# EAGLE design working (EAGLE 9.6.2)
COMPANY: ADAFRUIT INDUSTRIES; DRAWN: KTOWN; REV: D; YEAR: 2018
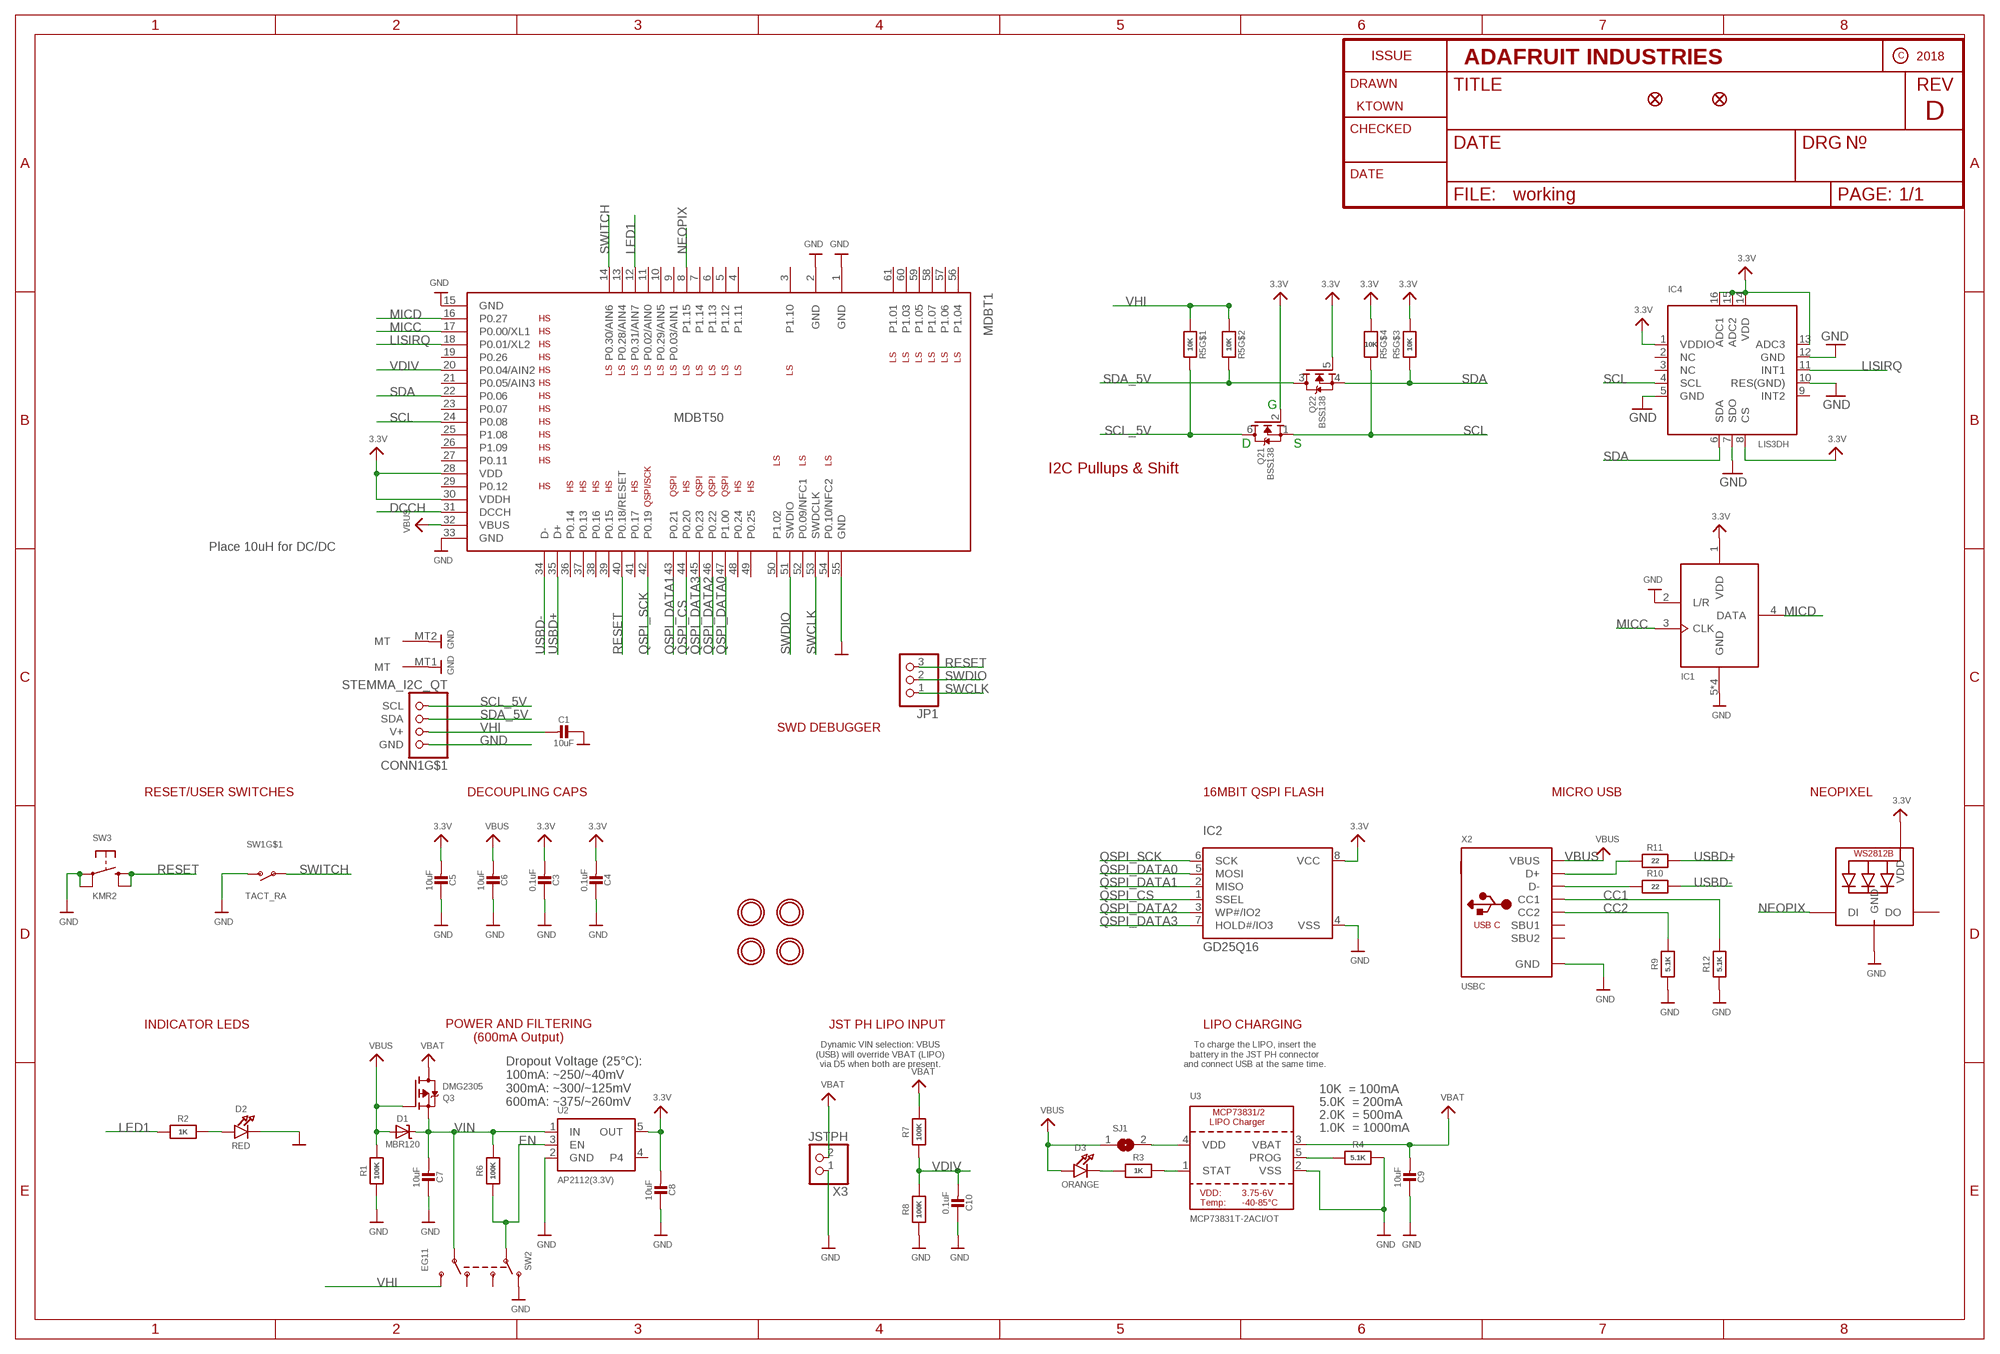
[diagram p0: schematic, sheet 1]

## Parts
C1  10uF  CAP_CERAMIC0805-NOOUTLINE  [0805-NO]
C3  0.1uF  CAP_CERAMIC0603_NO  [0603-NO]
C4  0.1uF  CAP_CERAMIC0603_NO  [0603-NO]
C5  10uF  CAP_CERAMIC0805-NOOUTLINE  [0805-NO]
C6  10uF  CAP_CERAMIC0805-NOOUTLINE  [0805-NO]
C7  10uF  CAP_CERAMIC0805-NOOUTLINE  [0805-NO]
C8  10uF  CAP_CERAMIC0805-NOOUTLINE  [0805-NO]
C9  10uF  CAP_CERAMIC0805-NOOUTLINE  [0805-NO]
C10  0.1uF  CAP_CERAMIC0603_NO  [0603-NO]
CONN1  STEMMA_I2C_QT  [JST_SH4]
D1  MBR120  DIODE-SCHOTTKYSOD-123  [SOD-123]
D2  RED  LED0805_NOOUTLINE  [CHIPLED_0805_NOOUTLINE]
D3  ORANGE  LED0805_NOOUTLINE  [CHIPLED_0805_NOOUTLINE]
FID1  FIDUCIAL_1MM  [FIDUCIAL_1MM]
FID2  FIDUCIAL_1MM  [FIDUCIAL_1MM]
IC1  MIC_PDM_SPK0415  [SPK0415HM4H]
IC2  GD25Q16  SPIFLASH_8PIN  [SOIC8_150MIL]
IC4  LIS3DH  ACCEL_LIS3DHTR  [LGA16_3X3MM]
JP1  HEADER-1X3ROUND  [1X03_ROUND]
LED1  WS2812B_SK6805_1515  [SK6805_1515]
MDBT1  MDBT50  [MDBT50]
Q2  BSS138  MOSFET-N_DUAL  [SOT363]
Q3  DMG2305  MOSFET-P  [SOT23-R]
R1  100K  RESISTOR_0603_NOOUT  [0603-NO]
R2  1K  RESISTOR_0603_NOOUT  [0603-NO]
R3  1K  RESISTOR_0603_NOOUT  [0603-NO]
R4  5.1K  RESISTOR_0603_NOOUT  [0603-NO]
R5  10K  RESISTOR_4PACK  [RESPACK_4X0603]
R6  100K  RESISTOR_0603_NOOUT  [0603-NO]
R7  100K  RESISTOR_0603_NOOUT  [0603-NO]
R8  100K  RESISTOR_0603_NOOUT  [0603-NO]
R9  5.1K  RESISTOR_0603_NOOUT  [0603-NO]
R10  22  RESISTOR_0603_NOOUT  [0603-NO]
R11  22  RESISTOR_0603_NOOUT  [0603-NO]
R12  5.1K  RESISTOR_0603_NOOUT  [0603-NO]
SJ1  SOLDERJUMPER  [SOLDERJUMPER_ARROW_NOPASTE]
SW1  TACT_RA  SWITCH_SPST_TACT_RA  [SPST_TACTILE_RA]
SW2  EG11  SWITCH_DPDTEG1390  [EG1390]
SW3  KMR2  SWITCH_TACT_SMT4.6X2.8  [BTN_KMR2_4.6X2.8]
U2  AP2112(3.3V)  VREG_SOT23-5  [SOT23-5]
U3  MCP73831T-2ACI/OT  MCP73831/2  [SOT23-5]
U$10  MOUNTINGHOLE_SLOT4MM  [SLOT_4MM_PLATED]
U$12  MOUNTINGHOLE_SLOT4MM  [SLOT_4MM_PLATED]
U$14  MOUNTINGHOLE_SLOT4MM  [SLOT_4MM_PLATED]
U$16  MOUNTINGHOLE_SLOT4MM  [SLOT_4MM_PLATED]
X2  USBC  USB_C  [USB_C_CUSB31-CFM2AX-01-X]
X3  JSTPH  CON_JST_PH_2PIN_BATT  [JSTPH2_BATT]

## Nets
3.3V [highpower]: C3.2 C4.2 C5.2 C8.2 IC1.1(VDD) IC2.8(VCC) IC4.1(VDDIO) IC4.8(CS) IC4.13(ADC3) IC4.14(VDD) IC4.15(ADC2) IC4.16(ADC1) LED1.2(VDD) MDBT1.28(VDD) MDBT1.30(VDDH) Q2.2(1:G) Q2.5(2:G) R5.3 R5.5 U2.5(OUT)
CC1: R12.2 X2.A5(CC1)
CC2: R9.2 X2.B5(CC2)
D+: R11.1 X2.A6(D+) X2.B6(D+)
D-: R10.1 X2.A7(D-) X2.B7(D-)
DCCH: MDBT1.31(DCCH)
EN: R6.1 SW2.P1 U2.3(EN)
GND: C1.1 C3.1 C4.1 C5.1 C6.1 C7.1 C8.1 C9.1 C10.1 CONN1.1(GND) CONN1.MT1(MT) CONN1.MT2(MT) D2.C IC1.2(L/R) IC1.5(GND) IC1.6(GND) IC1.7(GND) IC1.8(GND) IC2.4(VSS) IC4.5(GND) IC4.7(SDO) IC4.10(RES(GND)) IC4.12(GND) LED1.4(GND) MDBT1.1(GND) MDBT1.2(GND) MDBT1.15(GND) MDBT1.33(GND) MDBT1.55(GND) R1.1 R4.2 R8.1 R9.1 R12.1 SW1.2(S) SW2.O1 SW3.A'(P1) SW3.A(P) U2.2(GND) U3.2(VSS) X2.A1B12(GND) X2.B1A12(GND) X3.1
LED1: MDBT1.12(P0.31/AIN7) R2.1
LISIRQ: IC4.11(INT1) MDBT1.18(P0.01/XL2)
MICC: IC1.3(CLK) MDBT1.17(P0.00/XL1)
MICD: IC1.4(DATA) MDBT1.16(P0.27)
N$1: D3.C R3.1
N$2 [highpower]: SJ1.2 U3.4(VDD)
N$5: D2.A R2.2
N$11: R3.2 U3.1(STAT)
N$12: R4.1 U3.5(PROG)
NEOPIX: LED1.1(DI) MDBT1.8(P1.15)
QSPI_CS: IC2.1(SSEL) MDBT1.44(P0.20)
QSPI_DATA0: IC2.5(MOSI) MDBT1.47(P1.00)
QSPI_DATA1: IC2.2(MISO) MDBT1.43(P0.21)
QSPI_DATA2: IC2.3(WP#/IO2) MDBT1.46(P0.22)
QSPI_DATA3: IC2.7(HOLD#/IO3) MDBT1.45(P0.23)
QSPI_SCK: IC2.6(SCK) MDBT1.42(P0.19)
RESET: JP1.3 MDBT1.40(P0.18/RESET) SW3.B'(S1) SW3.B(S)
SCL: IC4.4(SCL) MDBT1.24(P0.08) Q2.1(1:S) R5.4
SCL_5V: CONN1.4(SCL) Q2.6(1:D) R5.8
SDA: IC4.6(SDA) MDBT1.22(P0.06) Q2.4(2:S) R5.6
SDA_5V: CONN1.3(SDA) Q2.3(2:D) R5.7
SWCLK: JP1.1 MDBT1.53(SWDCLK)
SWDIO: JP1.2 MDBT1.51(SWDIO)
SWITCH: MDBT1.14(P0.30/AIN6) SW1.1(P)
USBD+: MDBT1.35(D+) R11.2
USBD-: MDBT1.34(D-) R10.2
VBAT [highpower]: C9.2 Q3.3(D) R7.2 U3.3(VBAT) X3.2
VBUS [highpower]: C6.2 D1.A D3.A MDBT1.32(VBUS) Q3.1(G) R1.2 SJ1.1 X2.A4B9(VBUS) X2.B4A9(VBUS)
VDIV: C10.2 MDBT1.20(P0.04/AIN2) R7.1 R8.2
VHI [highpower]: C1.2 CONN1.2(V+) R5.1 R5.2 SW2.S2
VIN [highpower]: C7.2 D1.C Q3.2(S) R6.2 SW2.P2 U2.1(IN)
Unconnected: IC4.2(NC) IC4.3(NC) IC4.9(INT2) LED1.3(DO) MDBT1.3(P1.10) MDBT1.4(P1.11) MDBT1.5(P1.12) MDBT1.6(P1.13) MDBT1.7(P1.14) MDBT1.9(P0.03/AIN1) MDBT1.10(P0.29/AIN5) MDBT1.11(P0.02/AIN0) MDBT1.13(P0.28/AIN4) MDBT1.19(P0.26) MDBT1.21(P0.05/AIN3) MDBT1.23(P0.07) MDBT1.25(P1.08) MDBT1.26(P1.09) MDBT1.27(P0.11) MDBT1.29(P0.12) MDBT1.36(P0.14) MDBT1.37(P0.13) MDBT1.38(P0.16) MDBT1.39(P0.15) MDBT1.41(P0.17) MDBT1.48(P0.24) MDBT1.49(P0.25) MDBT1.50(P1.02) MDBT1.52(P0.09/NFC1) MDBT1.54(P0.10/NFC2) MDBT1.56(P1.04) MDBT1.57(P1.06) MDBT1.58(P1.07) MDBT1.59(P1.05) MDBT1.60(P1.03) MDBT1.61(P1.01) SW1.MT1(MT) SW1.MT2(MT) SW2.O2 SW2.S1 U2.4 X2.A8(SBU1) X2.B8(SBU2)

## Notes on the sheet
- G
- D | S
- I2C Pullups & Shift
- Place 10uH for DC/DC
- SWD DEBUGGER
- RESET/USER SWITCHES | DECOUPLING CAPS | 16MBIT QSPI FLASH | MICRO USB | NEOPIXEL
- INDICATOR LEDS | JST PH LIPO INPUT | LIPO CHARGING
- POWER AND FILTERING
  (600mA Output)
- Dynamic VIN selection: VBUS
  (USB) will override VBAT (LIPO)
  via D5 when both are present.
- To charge the LIPO, insert the
  battery in the JST PH connector
  and connect USB at the same time.
- 10K  = 100mA
- Dropout Voltage (25°C):
  100mA: ~250/~40mV
  300mA: ~300/~125mV
  600mA: ~375/~260mV
- 5.0K  = 200mA
- 2.0K  = 500mA
- 1.0K  = 1000mA

## Library data of the parts
C1 C3-C10 = microbuilder:CAP_CERAMIC: Ceramic Capacitors For new designs, use the packages preceded by an '_' character since they are more reliable: The following footprints should be used on most boards: _0402 - Standard footprint for regular board layouts _0603 - Standard footprint for regular board layouts _0805 - Standard footprint for regular board layouts _1206 - Standard footprint for regular board layouts For extremely tight-pitch boards where space is at a premium, the following 'micro-pitch' footprints can be used (smaller pads, no silkscreen outline, etc.): _0402MP - Micro-pitch footprint for very dense/compact boards _0603MP - Micro-pitch footprint for very dense/compact boards _0805MP - Micro-pitch footprint for very dense/compact boards _1206MP - Micro-pitch footprint for very dense/compact boards
CONN1 = microbuilder:STEMMA_I2C
D1 = microbuilder:DIODE-SCHOTTKY
D2 D3 = microbuilder:LED: LED 0603 - 0603 Surface Mount Package 2mA: Green LED - Low Power (3.9mcd, 2ma, 1.7Vf) - Digikey: 475-2709-2-ND Orange LED - Low Power (9.8mcd, 2ma, 1.8Vf) - Digikey: 475-1194-2-ND Red LED - Low Power (5mcd, 2ma, 1.8Vf) - Digikey: 475-1195-2-ND Yellow LED - Low Power (7mcd, 2ma, 1.8Vf) - Digikey: 475-1196-2-ND 5mA: Blue LED - Low Power (17mcd, 5ma, 2.9Vf) - Digikey: LNJ937W8CRACT-ND 0805 - 0805 Surface Mount Package 2mA: Red LED (8.8mcd, 2mA, 1.8Vf, Clear) - Low Power [Digikey: 475-2510-1-ND] Green LED (5mcd, 2mA, 1.8Vf, Clear) - Low Power [Digikey: 475-2730-1-ND] Yellow LED (11.3mcd, 2mA, 1.8Vf, Clear) - Low Power [Digikey: 475-2555-1-ND] 20mA: Red LED (104mcd, 20mA, Diffused) - LS R976 [Digikey: 475-1278-6-ND] Red LED (12mcd, 20mA, 2.0Vf, Clear) - APT2012EC [Digikey: 754-1128-1-ND] Green LED (15mcd, 20mA, 2.2Vf, Clear) - APT2012GC [Digikey: 754-1131-1-ND] Orange LED (160mcd, 20mA, 2.1Vf, Clear) - APT2012SECK [Digikey: 754-1130-1-ND] 1206 - 1206 Surface Mount Package Green LED (26mcd, 20mA, Diffused) - LG N971 [Digikey: 475-1407-6-ND] Red LED (15mcd, 20mA, Diffused) - LH N974 [Digikey: 475-1416-6-ND] Cree - Cree High-Power Surface Mount LEDs XPEBWT-L1-0000-00D50 - White 111lm 350mA 2.9Vf 6200K 110° XTEAWT-00-0000-00000LEE3 - White 114lm 350mA 2.85Vf 5000K 115° Everlight - Everlight 45-21 Series Surface Mount LEDs 45-21/QK2C-B2832AC2CB2/2T - Warm White 2000mcd 20mA 3.25Vf 3050K 120° 45-21/LK2C-B38452C4CB2/2T - Nuetral White 2000mcd 20mA 3.25Vf 4150K 120° 45-21/LK2C-B50634C6CB2/2T - Cold White 2200mcd 20mA 3.25Vf 5650K 120° PLCC2 Reverse Mount LS T77K-J1L2-1-0-2-R18-Z - Red 11.25mcd 2mA 1.8Vf 630nm 120° LO T77K-L1M2-24-Z - Orange 19.6mcd 2mA 1.8Vf 606nm 120° LY T77K-K2M1-26-Z - Yellow 15.7mcd 2mA 1.8Vf 587nm 120°
FID1 FID2 = microbuilder:FIDUCIAL: Fiducial Alignment Points Various fiducial points for machine vision alignment.; BOM: EXCLUDE
IC1 = microbuilder:MIC_PDM
IC2 = microbuilder:SPIFLASH_8PIN: SOIC8 SPI Flash Be careful with the size since SOIC8 flash comes in several 'widths' SOIC8 150 mil M25P16 - 16Mbit (2Mbit x 8) Serial Flash (75MHz SPI Bus), Supply: 2.7-3.6V Digikey: SOIC8 - M25P16-VMN6P-ND SOIC8 208 mil W25Q16BVSSIG - 16Mbit (2Mbit x 8) Serial Flash (104MHz SPI Bus), Supply: 2.7-3.6V Digikey: SOIC8 - W25Q16BVSSIG-ND
IC4 = adafruit_sensor:ACCEL_LIS3DHTR: LIS3DHTR 3-Axis Accelerometer with I2C/SPI Interface VDD: 1.71-3.6V VDDIO: 1.71-VDD+0.1V Scale: +/-2g, 4g, 8g, 16g with 16--bit data output Temp:: -40°C - 85°C Mouser: 511-LIS3DHTR Digikey: 497-10613-1-ND
JP1 = microbuilder:HEADER-1X3: PIN HEADER
LED1 = microbuilder:WS2812B
MDBT1 = microbuilder:MDBT50: Raytac Corporation MDBT50 Bluetooth Low Energy Module based on Noridc nRF52840 Source: Raytac datasheet
Q2 = microbuilder:MOSFET-N_DUAL: Dual N-Channel MOSFET SOT363 (2.0x1.25mm) 2N7002PS - 60V, 320mA [Digikey: 568-5984-1-ND]
Q3 = microbuilder:MOSFET-P: P-Channel Mosfet LEGEND VDS: Voltage Drain-Source ID: Drain Current RDS(ON): Drain-Source On-State Resistance VGS(TH): Gate-Source Threshold Voltage CISS: Drain-Source Input Capacitance SOT-23 Name VDS ID RDS(ON) VGS(TH) CISS Order Number IRLML5103 30V 760mA 600 mOhm -- 75pF @ 25V Digikey: IRLML5103PBFCT-ND IRLML6401 12V 4.3A 50 mOhm 950mV @ 250µA 830pF @ 10V Digikey: IRLML6401PBFTR-ND NTR0202PL 20V 400mA 800 mOhm 2.3V @ 250uA 70pF @ 5V Digikey: NTR0202PLT1GOSTR-ND NTR4101PT1G 20V 1.8A 85 mOhm 1.2V @ 250uA 675pF @ 10V Digikey: NTR4101PT1GOSCT-ND DMP2004K 20V 600mA 900 mOhm 1V @ 250uA 175pF @ 16V Digikey: DMP2004KDICT-ND PMV65XP 20V 3.9A 76 mOhm 950mV @ 1mA 725pF @ 20V Digikey: 568-2358-2-ND TO-252 Name VDS ID RDS(ON) VGS(TH) CISS Order Number AOD417 30V 25A 34 mOhm 3V @ 250µA 920pF @ 15V Digikey: 785-1106-2-ND PowerPak Name VDS ID RDS(ON) VGS(TH) CISS Order Number AON7401 30V 12A 14 mOhm 3V @ 250µA 2600pF @ 15V Digikey: 785-1302-1-ND
R1-R4 R6-R12 = microbuilder:RESISTOR: Resistors For new designs, use the packages preceded by an '_' character since they are more reliable: The following footprints should be used on most boards: _0402 - Standard footprint for regular board layouts _0603 - Standard footprint for regular board layouts _0805 - Standard footprint for regular board layouts _1206 - Standard footprint for regular board layouts For extremely tight-pitch boards where space is at a premium, the following 'micro-pitch' footprints can be used (smaller pads, no silkscreen outline, etc.): _0402MP - Micro-pitch footprint for very dense/compact boards _0603MP - Micro-pitch footprint for very dense/compact boards _0805MP - Micro-pitch footprint for very dense/compact boards _1206MP - Micro-pitch footprint for very dense/compact boards
R5 = microbuilder:RESISTOR_4PACK: Resistor Packs (4 resistors) 4 x 0603 10K 1/16W - Digikey: YC164J-10KCT-ND
SJ1 = microbuilder:SOLDERJUMPER: SMD Solder JUMPER Solder the two pads together to create a connection, or remove the solder to break it. REFLOW - Use this footprint for solder paste and reflow ovens. WAVE - Use this footprint for hand-soldering (larger pads). CLOSED - Has a trace between the two pads to ensure it is closed by default. The trace needs to be cut to disable the jumper, and can be closed again by creating a solder bridge between the two pads.; BOM: EXCLUDE
SW1 = adafruit_electromech:SWITCH_SPST: Switch - SPST 4UCon 19192 (6.7x2.6mm SMT)
SW2 = adafruit_electromech:SWITCH_DPDT: Switch - DPDT A DPDT Switch acts like an SPDT switch, but has a pair of switches instead of just one. Vertical - 0.3A @ 6V SMT - Digikey: JS202011SCQN
SW3 = adafruit_electromech:SWITCH_TACT_SMT: SMT Tact Switches 6x6mm - Digikey: P12940SCT-ND KMR2 (4.6x2.8mm) - Digikey: 401-1426-1-ND EVQ-PQHB55 - Light Touch, 160GF (4.5x4.5mm) - Digikey: P8090SCT-ND KMT0 - KMT021 NGJ LHS (etc.) IP68/Waterproof - Digikey: CKN10289CT-ND
U2 = microbuilder:VREG_SOT23-5: SOT23-5 Fixed Voltage Regulators Part Current Out V Out V In V Dropout θJA (°C/W) TJ (°C) Digikey Part No. ADP121 150mA 3.3V 3.4-5.5V 0.09V @ 150mA -- -- ADP121-AUJZ33R7CT-ND ADP121 150mA 3.0V 3.1-5.5V 0.09V @ 150mA -- -- ADP121-AUJZ30R7CT-ND ADP122 300mA 3.3V 3.4-5.5V 0.085V @ 300mA -- -- ADP122AUJZ-3.3-R7CT-ND ADP1712 300mA 3.3V 3.5-5.5V 0.17V @ 300mA -- -- ADP1712AUJZ-3.3-R7TR-ND AP7311 (Low Cost) 150mA 3.3V 3.5-6V 0.15V @ 150mA -- -- AP7311-33WG-7DICT-ND LD39015M18R 150mA 1.8V 1.9V-5.5V 0.08V @ 100mA -- -- 497-6977-1-ND LP2985A-33DBVR 150mA 3.3V 3.3-16V 0.28V @ 150mA 206 150 296-18479-1-ND MCP1824T-3302E/OT 300mA 3.3V 3.5V-6V 0.2V @ 300mA -- -- MCP1824T-3302E/OTCT-ND MIC5205-2.5YM5 TR 150mA 2.5V 2.7-16V 0.165V @ 150mA -- -- 576-1257-2-ND MIC5205-3.0YM5 TR 150mA 3.0V 3.2V-16V 0.165V @ 150mA -- -- 576-1258-2-ND MIC5205-3.3YM5 TR 150mA 3.3V 3.5V-16V 0.165V @ 150mA -- -- 576-1259-2-ND TPS780330220 150mA 3.3V+2.2V 3.6-5.5V 250mV Max -- -- 296-23332-1-ND TDA3663/N1,135 100mA 3.3V 3.5-45V 0.18V @ 50mA -- -- 568-5343-1-ND Max operating temp can be calculated using θJA, TJ (max junction temperature), and power in watts. Set the "Maximum Ambient Temperature" until it reaches TJ ("Max Junction Temperature"), which is the absolute limit for safe use of the regulator: Heat Sink Temperature Calculator <http://www.daycounter.com/Calculators/Heat-Sink-Temperature-Calculator.phtml> For example, With 12V source into a 3.3V LP2985 and a 30mA load, we are dissipating (12V-3.3V) * 0.03A = 0.261W. With a θJA of 206 °C/W, a TJ of 150°C, and 261mW we can safely use the chip without a heat sink up to 75°C (=147.1°C Junction Temperature).
U3 = microbuilder:MCP73831/2: MCP73831/2 LIPO Charger VDD: 3.75 - 6V Temp -40 - 85°C Programmable Charge Rate: 15-500mA NOTE: STAT is a tri-state logic output on the MCP73831 and an open-drain output on the MCP73832. SOT23-5 with 4.2V output and tri-state logic on STAT = MCP73831T-2ACI/OT
U$10 U$12 U$14 U$16 = adafruit_electromech:MOUNTINGHOLE: Mounting Hole For #2 screws (0.086"/2.18mm width, 0.094"/2.4mm hole) use 2.5mm
X2 = adafruit_electromech:USB_C: USB Type-C USB 2.0 Connector
X3 = adafruit_electromech:CON_JST_PH_2PIN: JST 2-Pin Right-Angle Connector PH-Series - 4UConnector: 17311 SH-Series - 4UConnector: 07278

## Net classes
1 highpower: width 0.305 mm, drill 0.483 mm
2 lowpower: width 0.254 mm, drill 0.483 mm

## Board
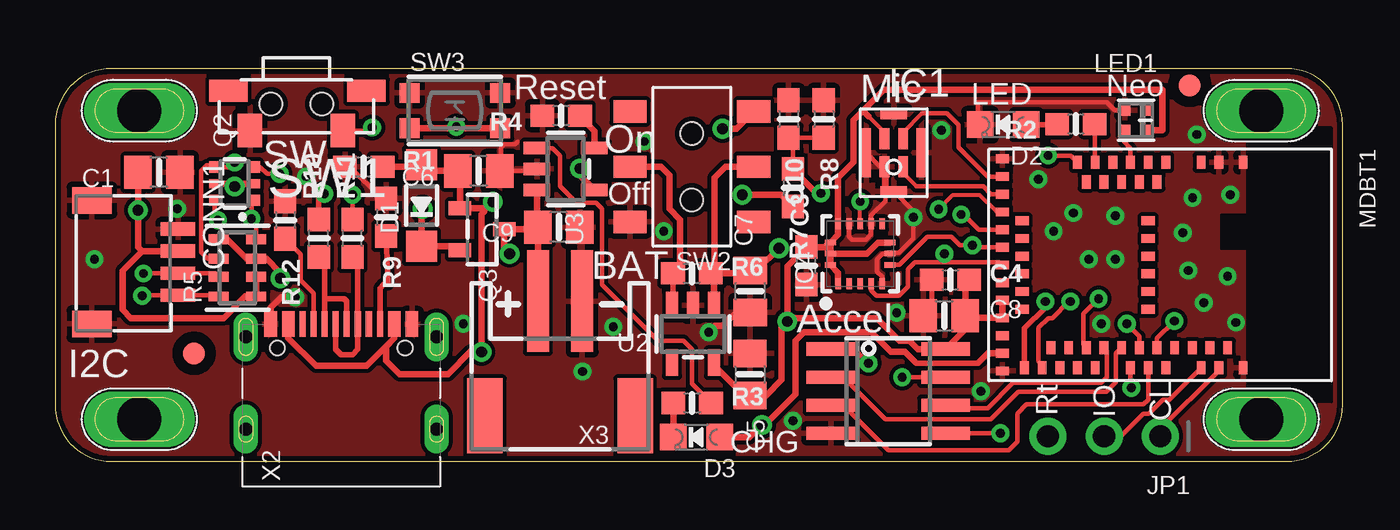
[diagram p1: board, top side]
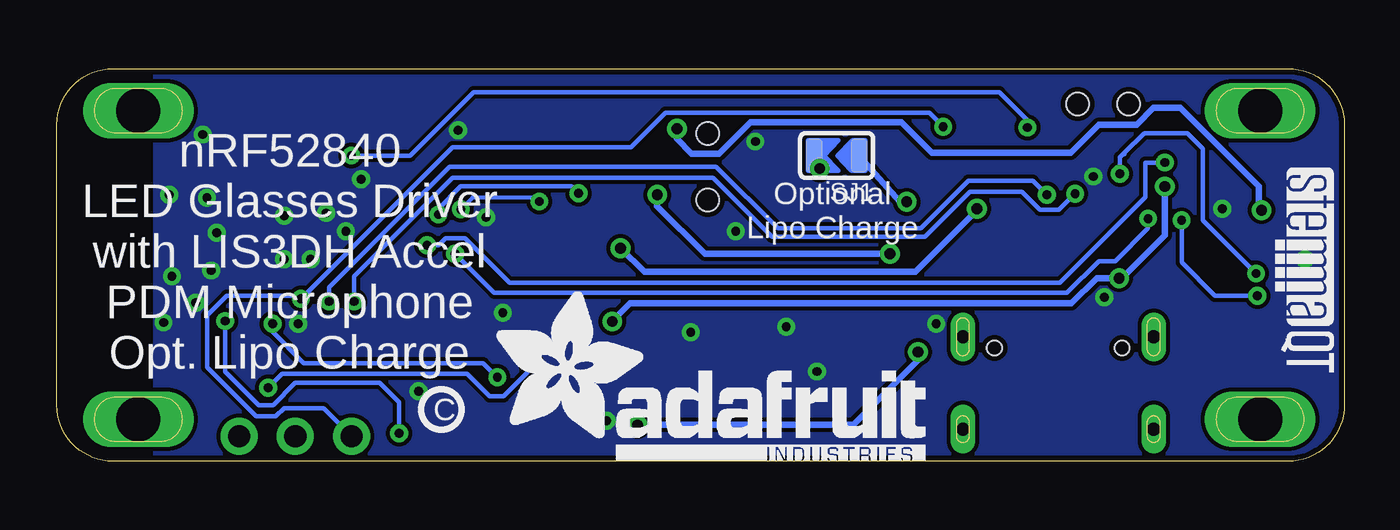
[diagram p2: board, bottom side, seen from below]

Size 58.29 x 17.78 mm. Coordinates in mm from the lower left corner, seen from the top.
Outline: 0,15.24 0,2.54 arc90 2.54,0 55.75,0 arc90 58.29,2.54 58.29,15.24 arc90 55.75,17.78 2.54,17.78 arc90 0,15.24
Copper layers (1*16): Top 0.035mm / dielectric 1.5mm / Bottom 0.035mm
Design rules "adafruit 7-7 *": minimum track width 7mil, minimum drill 15.5mil, track to track 7mil, track to pad 7mil, pad to pad 7mil, via to via 7mil, smd to smd 7mil, copper to edge 10mil, drill to drill 8mil, minimum pad ring 10mil, minimum via ring 8mil, stop-mask expansion 2mil, vias tented up to drill 20mil, thermal gap 10mil

### Footprints (pad centres in the part's own frame; a part is rotated, then mirrored left to right if it is on the bottom)
0805-NO = smd 1.24 x 1.5: 1 -0.95,0; 2 0.95,0
0603-NO = smd 1.075 x 1: 1 -0.85,0; 2 0.85,0
JST_SH4 = smd 0.6 x 1.55: 1 -1.5,2.514; 2 -0.5,2.514; 3 0.5,2.514; 4 1.5,2.514 | smd 1.2 x 1.8: MT1 -2.8,-1.386; MT2 2.8,-1.386
SOD-123 = smd 1.4 x 1.4: A 1.85,0; C -1.85,0
CHIPLED_0805_NOOUTLINE = smd 1.2 x 1.2: A 0,-1.05; C 0,1.05
FIDUCIAL_1MM = smd 1 x 1: 1 0,0
SPK0415HM4H = smd 0.45 x 0.95: 1 0.425,-0.625; 2 0.425,0.625; 3 -0.425,0.625; 4 -0.425,-0.625 | smd 1.2 x 0.45: 5 0,-1.75; 7 0,1.75 | smd 0.45 x 2.2: 6 1.25,0; 8 -1.25,0
SOIC8_150MIL = smd 0.6 x 2.2: 1 -1.905,-2.6; 2 -0.635,-2.6; 3 0.635,-2.6; 4 1.905,-2.6; 5 1.905,2.6; 6 0.635,2.6; 7 -0.635,2.6; 8 -1.905,2.6
LGA16_3X3MM = smd 0.5 x 0.25: 1 -1.35,1; 2 -1.35,0.5; 3 -1.35,0; 4 -1.35,-0.5; 5 -1.35,-1; 9 1.35,-1; 10 1.35,-0.5; 11 1.35,0; 12 1.35,0.5; 13 1.35,1 | smd 0.25 x 0.5: 6 -0.5,-1.35; 7 0,-1.35; 8 0.5,-1.35; 14 0.5,1.35; 15 0,1.35; 16 -0.5,1.35
1X03_ROUND = drill 1 pad 1.676: 1 -2.54,0; 2 0,0; 3 2.54,0
SK6805_1515 = smd 0.5 x 0.5: 1 -0.5,-0.45; 2 0.5,-0.45; 3 0.5,0.45; 4 -0.5,0.45
MDBT50 = smd 0.6 x 0.4: 1 -4.65,3.75; 2 -4.65,2.65; 3 -4.65,1.85; 4 -4.65,0.25; 5 -3.75,-0.15; 6 -4.65,-0.55; 7 -3.75,-0.95; 8 -4.65,-1.35; 9 -3.75,-1.75; 10 -4.65,-2.15; 11 -3.75,-2.55; 12 -4.65,-2.95; 13 -3.75,-3.35; 14 -4.65,-3.75; 34 4.65,-6.15; 35 4.65,-5.35; 36 3.75,-4.95; 37 4.65,-4.55; 38 3.75,-4.15; 39 4.65,-3.75; 40 3.75,-3.35; 41 4.65,-2.95; 42 3.75,-2.55; 43 3.75,-1.75; 44 4.65,-1.35; 45 3.75,-0.95; 46 4.65,-0.55; 47 3.75,-0.15; 48 4.65,0.25; 49 3.75,0.65; 50 3.75,1.45; 51 4.65,1.85; 52 3.75,2.25; 53 4.65,2.65; 54 3.75,3.05; 55 4.65,3.75 | smd 0.4 x 0.6: 15 -4.8,-7.15; 16 -4,-7.15; 17 -3.2,-7.15; 18 -2.4,-7.15; 19 -2,-6.25; 20 -1.6,-7.15; 21 -1.2,-6.25; 22 -0.8,-7.15; 23 -0.4,-6.25; 24 0,-7.15; 25 0.4,-6.25; 26 0.8,-7.15; 27 1.2,-6.25; 28 1.6,-7.15; 29 2,-6.25; 30 2.4,-7.15; 31 3.2,-7.15; 32 4,-7.15; 33 4.8,-7.15; 56 -2,-0.55; 57 -1.2,-0.55; 58 -0.4,-0.55; 59 0.4,-0.55; 60 1.2,-0.55; 61 2,-0.55
SOT363 = smd 0.5 x 0.5: 1 -0.75,-0.9; 3 0.75,-0.9; 4 0.75,0.9; 6 -0.75,0.9 | smd 0.4 x 0.5: 2 0,-0.9; 5 0,0.9
SOT23-R = smd 0.635 x 1.016: 1 -0.95,-1; 2 0.95,-1; 3 0,1
RESPACK_4X0603 = smd 0.45 x 0.9: 1 -1.3,-0.85; 2 -0.4,-0.85; 3 0.4,-0.85; 4 1.3,-0.85; 5 1.3,0.85; 6 0.4,0.85; 7 -0.4,0.85; 8 -1.3,0.85
SOLDERJUMPER_ARROW_NOPASTE = smd 0.762 x 1.524: 1 -1.016,0; 2 1.016,0
SPST_TACTILE_RA = smd 1.1 x 1.5: 1 -2.1,0.9; 2 2.1,0.9 | smd 1.75 x 1: MT1 -3.175,-0.9; MT2 3.075,-0.9 | hole 1: -1.15,-0.3; 1.15,-0.3
EG1390 = smd 1 x 1.5: O1 -2.5,2.8; O2 -2.5,-2.8; P1 0,2.8; P2 0,-2.8; S1 2.5,2.8; S2 2.5,-2.8 | hole 1: 1.5,0; -1.5,0
BTN_KMR2_4.6X2.8 = smd 0.9 x 0.9: A 2.05,0.8; A' -2.05,0.8; B 2.05,-0.8; B' -2.05,-0.8
SOT23-5 = smd 0.55 x 1.2: 1 -0.95,-1.3; 2 0,-1.3; 3 0.95,-1.3; 4 0.95,1.3; 5 -0.95,1.3
SLOT_4MM_PLATED = drill 2 pad 2.4 long: P$1 0,0
USB_C_CUSB31-CFM2AX-01-X = smd 0.575 x 1.15: A1B12 -3.2,3.545; A4B9 -2.4,3.545; B1A12 3.2,3.545; B4A9 2.4,3.545 | smd 0.275 x 1.15: A5 -1.25,3.545; A6 -0.25,3.545; A7 0.25,3.545; A8 1.25,3.545; B5 1.75,3.545; B6 0.75,3.545; B7 -0.75,3.545; B8 -1.75,3.545 | drill 0.6 pad 1 long: M1 -4.32,2.97; M2 4.32,2.97; M3 -4.32,-1.21; M4 4.32,-1.21 | hole 0.65: 2.89,2.47; -2.89,2.47
JSTPH2_BATT = smd 1 x 4.6: 1 -1,-3.7; 2 1,-3.7 | smd 1.6 x 3.4: NC1 -3.4,1.5; NC2 3.4,1.5

### Placement (x,y rotation side)
C1  4.7,13.08 180 top
C3  34.01,8.85 90 top
C4  40.54,8.22 0 top
C5  31.46,3.94 270 top
C6  19.18,13.14 180 top
C7  31.47,7.7 90 top
C8  40.26,6.59 0 top
C9  22.81,10.6 180 top
C10  33.21,15.49 270 top
CONN1  3.05,9.02 270 top
D1  16.59,11.58 90 top
D2  42.93,15.24 90 top
D3  29.03,1.09 90 top
FID1  51.37,17.02 0 top
FID2  6.29,4.89 0 top
IC1  37.97,13.97 180 top
IC2  37.72,3.17 270 top
IC4  36.45,9.4 90 top
JP1  47.5,1.14 180 top
LED1  48.94,15.44 0 top
MDBT1  50.04,8.89 270 top
Q2  8.13,12.57 90 top
Q3  19.33,10.5 270 top
R1  13.97,13.34 0 top
R2  46.22,15.27 180 top
R3  28.84,2.64 0 top
R4  22.91,15.65 180 top
R5  8.26,8.76 90 top
R6  28.83,8.51 0 top
R7  33.4,12.38 270 top
R8  34.8,15.49 270 top
R9  14.99,11.05 270 top
R10  11.94,10.1 90 top
R11  13.46,10.1 90 top
R12  10.41,10.92 270 top
SJ1  22.99,13.84 180 bottom
SW1  10.92,15.88 180 top
SW2  28.83,13.34 90 top
SW3  18.1,15.88 0 top
U2  28.88,5.77 180 top
U3  23.11,13.23 270 top
U$10  3.81,15.88 0 top
U$12  3.81,1.91 0 top
U$14  54.61,1.91 0 top
U$16  54.61,15.88 0 top
U$28  [STEMMAQT]  3.11,13.27 270 bottom
U$37  [ADAFRUIT_TEXT_20MM]  38.54,0.06 0 bottom
U$63  [PCBFEAT-REV-040]  40.89,2.35 0 bottom
X2  12.95,2.67 0 top
X3  22.86,3.56 180 top

### Tracks (layer width: path | path; a pad name or v marks a point on that pad's centre or on a via)
3.3V  (via drill 0.48)
  Top 0.178: 37.55,14.9 36.83,15.62
  Top 0.305: U2.5 29.83,4.34 30.8,3.37 31.08,3.37 C5.2 32.2,2.99 32.89,3.68 32.89,6.48 33.15,6.48 | C8.2 41.21,5.97 IC2.8 39.07,5.08 38.69,5.46 38.23,5.46 37.21,6.48 33.15,6.48 | C8.2 41.31,6.49 MDBT1.30 MDBT1.28 | C4.2 41.21,8.04 C8.2 | IC4.14 35.45,10.25 IC4.13 35.45,12.84 36.14,13.54 36.14,15.44 36.64,15.94 | IC4.14 IC4.15 | IC4.15 IC4.16 35.45,8.55 IC4.1 | IC4.8 37.25,9.9 36.75,9.4 IC4.15 | IC4.14 35.03,9.9 34.84,9.7 C3.2 33.15,8.84 v33.15,6.34 33.15,6.48 | LED1.2 50.14,14.99 50.14,16.83 37.53,16.83 36.64,15.94 | 36.83,15.62 36.64,15.81 36.64,15.94 | IC1.1 37.55,14.9 | Q2.5 Q2.2 8.26,12.57 v8.13,12.45 | v10.2,8.29 10.2,8.54 9.57,9.16 R5.3 8.68,9.16 7.78,10.06 R5.5
  Bottom 0.305: v33.15,6.34 32.34,7.14 12.35,7.14 11.21,8.29 v10.2,8.29 10.06,8.29 8.13,10.23 v8.13,12.45
CC1
  Top 0.203: X2.A5 11.7,7.6 11.11,8.19 11.11,9.37 R12.2
CC2
  Top 0.254: X2.B5 14.7,7.85 14.9,8.04 15.07,8.04 R9.2
D+
  Top 0.254: R11.1 13.7,9.01 X2.B6 13.7,5.07 13.46,4.83 12.95,4.83 12.7,5.08 X2.A6
D-
  Top 0.254: X2.B7 12.2,7.37 | 12.2,7.37 12.2,8.98 R10.1 | X2.A7 13.2,7.24 13.08,7.37 12.2,7.37
EN
  Top 0.254: R6.1 27.98,7.12 U2.3
  Top 0.305: R6.1 28.3,8.83 28.3,10.95 27.81,11.43 27.81,12.95 27.43,13.34 SW2.P1
GND  (via drill 0.4)
  Top 0.203: IC4.5 37.45,8.35 37.21,8.59 37.21,9.14 37.47,9.4 IC4.7 37.84,9.44 38.2,9.44 38.86,10.11 v38.86,11.05 38.86,11.33 IC1.7 37.97,12.32 37.59,12.32 37.59,11.77 36.95,11.13 IC4.10 36.95,10.28 36.7,10.03 36.07,10.03 35.94,10.16 IC4.12 | IC1.2 37.35,13.35 IC1.6 | LED1.4 47.99,15.89 47.62,16.26 41.78,16.26 41.78,15.33 D2.C | C4.1 39.69,6.97 C8.1 | R1.1 13.34,13.34 14.77,11.9 R9.1 | U3.2 21.73,13.14 C6.1 20.19,13.21 20.19,14.22 20.32,14.35 20.78,14.35 20.83,14.35 20.93,14.46
  Top 0.305: IC1.2 37.59,13.3 37.59,12.32 | v29.59,5.84 29.89,6.14 30.24,6.14 30.85,6.75 C7.1 | X2.A1B12 9.75,6.96 10.22,7.43 v10.86,7.43
  other vias: 33.4,1.84 25.27,6.1 23.88,4.06 38.1,6.73 40.13,14.99 47.37,6.22 41.91,3.17 5.52,11.43 1.78,9.14 11.37,12.89 18.48,6.22 44.51,12.76 27.56,10.41 26.67,14.48 53.21,12.06 51.5,11.94 51.05,10.35 51.31,8.64 53.09,8.38 53.47,6.29 52.01,7.18 48.01,9.14 48.01,11.11 46.1,11.24 46.8,9.14 45.21,10.41 51.69,14.8
  pour Top: 0,17.65 58.29,17.65 58.29,0 0,0
  pour Bottom: 0,17.65 53.85,17.65 53.85,0 0,0
LED1
  Top 0.203: MDBT1.12 47.09,15.24 R2.1
LISIRQ  (via drill 0.39)
  Top 0.178: IC4.11 v36.45,11.77 | v40.01,11.41 40.66,12.06 41.86,12.06 42.63,11.29 MDBT1.18
  Bottom 0.178: v36.45,11.77 36.62,11.94 39.48,11.94 v40.01,11.41
MICC
  Top 0.178: IC1.3 38.4,13.04 38.99,12.45
  Top 0.203: 38.99,12.45 42.02,12.45 42.38,12.09 MDBT1.17
MICD
  Top 0.178: IC1.4 38.4,14.9 39.24,15.75
  Top 0.203: 39.24,15.75 40.39,15.75 40.89,15.24 40.89,14.22 42.23,12.89 MDBT1.16
N$1
  Top 0.305: R3.1 27.99,1.1 D3.C
N$2  (via drill 0.48)
  Top 0.305: U3.4 23.75,12.95 v23.75,13.25
  Bottom 0.305: v23.75,13.25 SJ1.2
N$5
  Top 0.254: R2.2 45.34,15.24 D2.A
N$11
  Top 0.203: R3.2 28.83,3.5 28.83,5.08 28.45,5.46 27.3,5.46 24.77,8 24.77,11.43 24.49,11.7 23.69,11.7 23.58,11.81 23.5,11.81 22.86,12.45 22.86,13.84 22.52,14.18 U3.1
N$12
  Top 0.305: U3.5 24.41,14.95 23.76,15.6 R4.1
NEOPIX
  Top 0.203: MDBT1.8 48.69,14.18 48.39,14.48 48.39,14.94 LED1.1
QSPI_CS  (via drill 0.4)
  Top 0.203: MDBT1.44 48.69,3.38 v48.73,3.33 | v36.83,4.45 36.2,5.08 IC2.1
  Bottom 0.203: v48.73,3.33 48.09,3.97 39.71,3.97 38.7,2.95 38.07,2.95 36.83,4.19 v36.83,4.45
QSPI_DATA0  (via drill 0.4)
  Top 0.203: MDBT1.47 49.89,5.57 v50.67,6.35 | v42.8,1.27 IC2.5
  Bottom 0.203: v50.67,6.35 50.67,4.06 49.15,2.54 48.51,2.54 47.5,3.56 43.69,3.56 42.8,2.67 v42.8,1.27
QSPI_DATA1
  Top 0.203: IC2.2 35.69,3.81 37.59,1.91 42.36,1.91 43.61,3.15 47.6,3.15 48.03,3.58 48.03,4.88 MDBT1.43
QSPI_DATA2
  Top 0.203: MDBT1.46 49.49,2.79 49.27,2.58 43.98,2.58 43.56,2.16 43.56,0.89 43.18,0.51 37.72,0.51 35.69,2.54 IC2.3
QSPI_DATA3  (via drill 0.4)
  Top 0.203: MDBT1.45 49.09,5.67 v48.53,6.22 | v38.35,3.81 IC2.7
  Bottom 0.203: v48.53,6.22 48.53,5.86 47.12,4.45 38.99,4.45 v38.35,3.81
QSPI_SCK
  Top 0.203: IC2.6 40.45,2.41 42.22,2.41 43.37,3.56 47.37,3.56 47.62,3.8 47.62,5.01 MDBT1.42
RESET  (via drill 0.4)
  Top 0.203: MDBT1.40 46.56,5.27 46.56,6.68 v47.24,7.37 | 18.26,15.07 18.18,15.15 v18.16,15.15 18.09,15.07 17.86,15.07
  Top 0.305: 17.86,15.07 SW3.B' | 18.26,15.07 SW3.B
  Bottom 0.203: v18.16,15.15 18.8,15.79 30.74,15.79 32.3,14.22 40.39,14.22 v47.24,7.37 47.37,7.49 50.61,7.49 51.5,6.6 51.5,4.25 49.28,2.03 48.39,2.03 48.01,2.41 46.23,2.41 JP1.3
SCL  (via drill 0.39, 0.4)
  Top 0.203: 40.26,9.02 38.94,9.02 38.61,8.69 38.61,7.89 38.21,7.49 37.2,7.49 36.95,7.74 IC4.4 | MDBT1.24 42.76,9.02 40.26,9.02 | v40.26,9.4 40.26,9.02 | Q2.1 8.89,11.69 v8.89,10.99 9.11,10.77 R5.4
  Bottom 0.203: v40.26,9.4 38.49,7.63 12.55,7.63 11.11,9.07 10.36,9.07 8.89,10.54 v8.89,10.99
SCL_5V  (via drill 0.39)
  Top 0.203: R5.8 7.35,7.52 CONN1.4 3.96,7.52 v3.94,7.49 | v7.37,10.91 7.23,11.05 Q2.6
  Bottom 0.203: v3.94,7.49 5.85,7.49 7.37,9.01 v7.37,10.91
SDA  (via drill 0.39, 0.4)
  Top 0.203: MDBT1.22 41.53,9.69 v41.53,9.79 40.96,9.79 40.58,10.17 39.5,10.17 38.23,8.9 IC4.6 | v8.13,13.53 8.13,13.32 Q2.4 7.23,13.4 6.86,13.4 6.62,13.16 6.62,9.46 6.92,9.16 R5.6
  Bottom 0.203: v41.53,9.79 41.02,9.79 40.7,10.1 39.81,10.1 37.8,8.09 12.87,8.09 9,11.96 9,13.53 v8.13,13.53
SDA_5V  (via drill 0.39)
  Top 0.203: Q2.3 9.28,13.32 9.59,13.02 v10.16,13.02 | R5.7 7.25,8.52 CONN1.3 v4.01,8.52 v4,8.51
  Bottom 0.203: v4,8.51 6.41,10.92 6.41,14.16 7.11,14.86 9.06,14.86 9.95,13.96 | 9.95,13.91 9.95,13.96 | 9.95,13.96 10.16,13.76 v10.16,13.02
SWCLK
  Top 0.203: MDBT1.53 52.69,4.11 50.01,1.43 50.01,1.17 JP1.1
SWDIO
  Top 0.203: MDBT1.51 50.44,2.79 50.16,2.79 49.53,2.16 49.28,2.16 48.26,1.14 JP1.2
SWITCH  (via drill 0.4)
  Top 0.203: SW1.1 14.21,14.97 v14.35,15.11 | MDBT1.14 45.98,13.84 v44.96,13.84
  Bottom 0.203: v14.35,15.11 14.35,15.43 15.62,16.7 39.43,16.7 42.29,13.84 v44.96,13.84
USBD+  (via drill 0.4)
  Top 0.203: MDBT1.35 44.69,4.37 44.52,4.54 44.52,6.04 44.96,6.48 45.15,6.48 45.9,7.24 v45.97,7.24 | v13.46,12.06 R11.2
  Bottom 0.203: v45.97,7.24 45.97,7.87 40.51,13.34 28.45,13.34 25.65,10.54 19.18,10.54 17.02,12.7 14.1,12.7 v13.46,12.06
USBD-  (via drill 0.4)
  Top 0.254: v12.19,12.11 11.94,11.86 R10.2 | v44.83,7.24 44.83,6.96 43.89,6.02 MDBT1.34
  Bottom 0.203: v44.83,7.24 44.83,8.38 40.39,12.83 28.57,12.83 25.91,10.16 18.99,10.16 16.95,12.19 14.61,12.19 13.79,11.38 12.92,11.38 v12.19,12.11
VBAT  (via drill 0.48)
  Top 0.305: 21.86,10.54 C9.2 21.81,10.65 U3.3 | 21.86,10.54 X3.2 | 21.86,10.54 21.82,10.5 Q3.3 20.33,9.64 v20.57,9.4 | v31.11,12.06 32.87,12.06 R7.2
  Bottom 0.305: v20.57,9.4 28.96,9.4 31.11,11.56 v31.11,12.06
VBUS  (via drill 0.48)
  Top 0.254: 41.91,4.57 41.78,4.45 38.99,4.45 38.48,4.95
  Top 0.305: X2.A4B9 10.55,5.58 11.81,4.32 14.1,4.32 15.35,5.58 X2.B4A9 15.35,5.58 14.97,5.2 14.97,4.56 15.6,3.94 17.78,3.94 18.8,4.95 v19.3,4.95 19.3,11.18 19.43,11.3 19.43,11.37 | 19.43,11.37 19.43,11.43 19.41,11.45 Q3.1 18.33,13.04 C6.2 16.87,13.14 D1.A 16.49,13.34 R1.2 | v19.81,11.75 19.43,11.37 | D3.A 31.45,1.09 v32,1.65 32.13,1.65 33.53,3.05 33.53,5.46 33.91,5.84 36.96,5.84 37.85,4.95 38.48,4.95 | MDBT1.32 42.23,4.89 41.91,4.57
  Bottom 0.305: SJ1.1 20.12,11.75 v19.81,11.75 | v32,1.65 22.23,1.65 19.3,4.57 v19.3,4.95
VDIV  (via drill 0.4)
  Top 0.203: R8.2 C10.2 33.4,14.45 R7.1 | v41.02,11.18 41.08,11.24 41.83,10.49 MDBT1.20
  Top 0.305: R7.1 33.4,13.21 34.48,12.13 v34.67,12.13
  Bottom 0.203: v34.67,12.13 34.99,12.45 40.01,12.45 41.02,11.43 v41.02,11.18
VHI  (via drill 0.48, 0.5)
  Top 0.305: SW2.S2 30.85,15.05 v30.23,15.05 | CONN1.2 3.93,9.52 | 3.93,9.52 3.75,9.7 v3.75,11.37 C1.2 | R5.2 R5.1 8.61,7.46 7.62,6.48 3.43,6.48 3.05,6.86 3.05,8.64 3.93,9.52
  Bottom 0.305: v30.23,15.05 30.23,14.61 29.55,13.93 28.31,13.93 26.88,15.35 20.05,15.35 18.67,13.97 12.38,13.97 11.11,15.24 9.4,15.24 8.64,16 7.43,16 3.87,12.44 3.87,11.49 v3.75,11.37
VIN  (via drill 0.5)
  Top 0.305: Q3.2 18.15,9.73 D1.C 16.59,11.38 v16.64,11.43 | U2.1 29.83,8.36 R6.2 | R6.2 31.33,8.51 C7.2 31.76,8.65 v32.77,9.65 | R6.2 29.84,8.68 29.84,12.83 30.35,13.34 SW2.P2
  Bottom 0.305: v16.64,11.43 16.64,11.37 19.43,8.57 31.69,8.57 v32.77,9.65

### Text on the board
tPlace: Reset | Mic | LED | Neo | On | SW | Off | BAT | Accel | I2C | Rt | IO | CL | CHG
bPlace: Optional / Lipo Charge | nRF52840 / LED Glasses Driver / with LIS3DH Accel / PDM Microphone / Opt. Lipo Charge